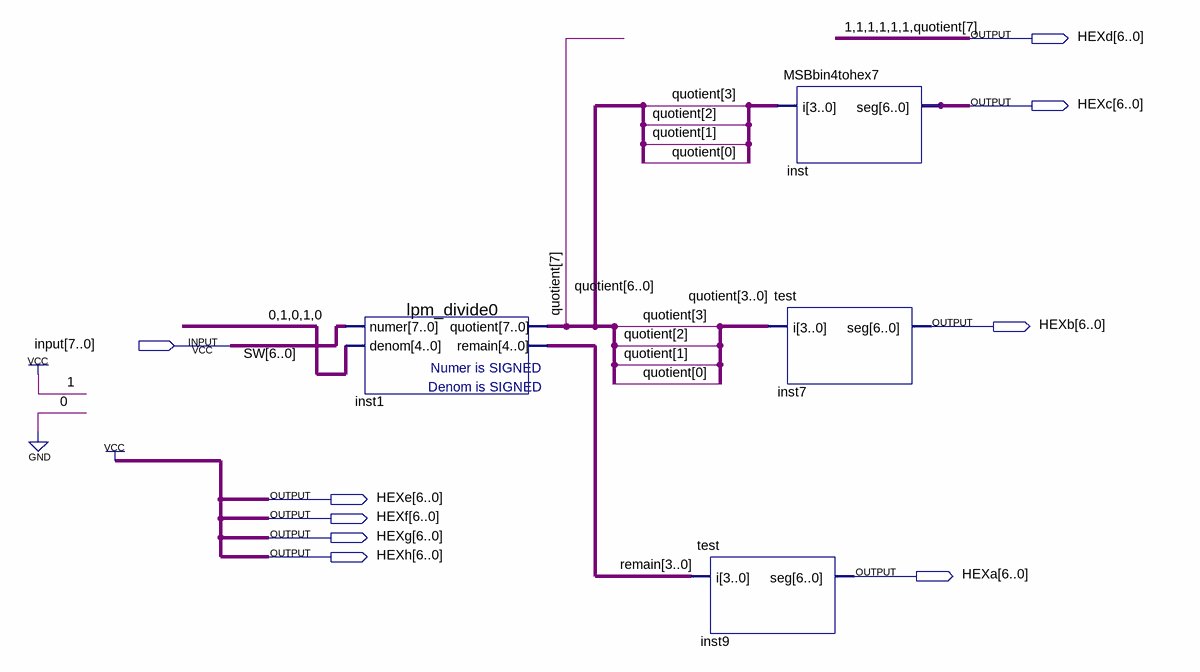
[diagram p0: schematic sheet]
// Quartus schematic bitwisemods.bdf as structural Verilog: 4 symbols, 9 pins
module bitwisemods (
  input  [7:0] \input ,
  output [6:0] HEXd,
  output [6:0] HEXc,
  output [6:0] HEXb,
  output [6:0] HEXe,
  output [6:0] HEXf,
  output [6:0] HEXg,
  output [6:0] HEXh,
  output [6:0] HEXa
);

  wire [3:0] remain, undriven;
  wire [6:0] quotient, SW;

  lpm_divide0 inst1 (.numer(SW), .denom(5'b01010), .quotient(quotient), .remain(remain));
  test inst9 (.i(remain), .seg(HEXa));
  MSBbin4tohex7 inst (.i(undriven), .seg(HEXc));
  test inst7 (.i(quotient[3:0]), .seg(HEXb));

  assign HEXd[6:1] = {6{1'b1}};
  assign HEXe = {7{1'b1}};
  assign HEXf = {7{1'b1}};
  assign HEXg = {7{1'b1}};
  assign HEXh = {7{1'b1}};

  // Other names for the same wires on the sheet: quotient[7] = HEXd[0]
endmodule
